# EAGLE design driver_board_one_module_pic (EAGLE 8.1.1)
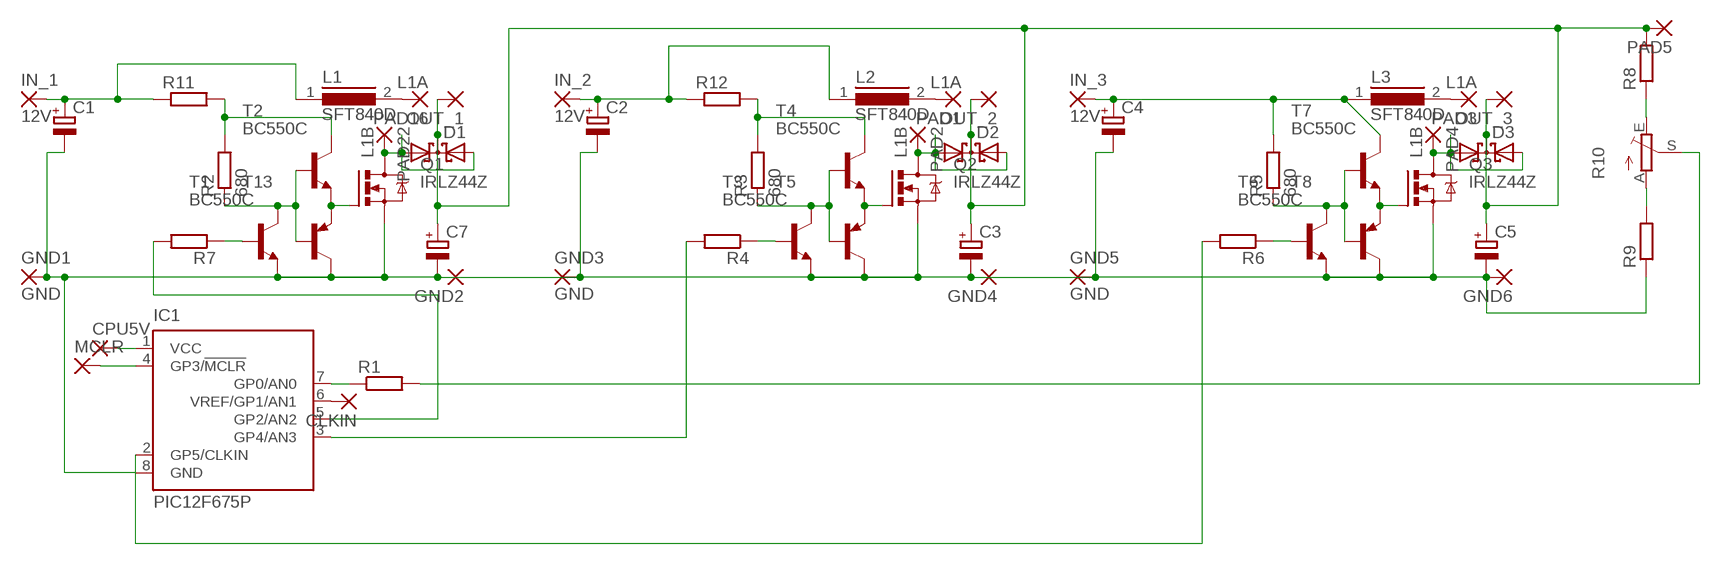
[diagram p0: schematic, sheet 1]

## Parts
C1  CPOL-EUE5-8.5  [E5-8,5]
C2  CPOL-EUE5-8.5  [E5-8,5]
C3  CPOL-EUE5-8.5  [E5-8,5]
C4  CPOL-EUE5-8.5  [E5-8,5]
C5  CPOL-EUE5-8.5  [E5-8,5]
C7  CPOL-EUE5-8.5  [E5-8,5]
CLKIN  2,54/0,8  [2,54/0,8]
CPU5V  2,54/0,8  [2,54/0,8]
D1  DIODE_2SCHOTTKY-SOT93V  [SOT93S]
D2  DIODE_2SCHOTTKY-SOT93V  [SOT93S]
D3  DIODE_2SCHOTTKY-SOT93V  [SOT93S]
GND1  GND  3,81/1,3  [3,81/1,3]
GND2  3,81/1,3  [3,81/1,3]
GND3  GND  3,81/1,3  [3,81/1,3]
GND4  3,81/1,3  [3,81/1,3]
GND5  GND  3,81/1,3  [3,81/1,3]
GND6  3,81/1,3  [3,81/1,3]
IC1  PIC12F675P  [DIL8]
IN_1  12V  3,81/1,3  [3,81/1,3]
IN_2  12V  3,81/1,3  [3,81/1,3]
IN_3  12V  3,81/1,3  [3,81/1,3]
L1  SFT840D  [SFT840D]
L2  SFT840D  [SFT840D]
L3  SFT840D  [SFT840D]
MCLR  2,54/0,8  [2,54/0,8]
OUT_1  3,81/1,3  [3,81/1,3]
OUT_2  3,81/1,3  [3,81/1,3]
OUT_3  3,81/1,3  [3,81/1,3]
PAD1  L1A  3,81/1,1  [3,81/1,1]
PAD2  L1B  3,81/1,1  [3,81/1,1]
PAD3  L1A  3,81/1,1  [3,81/1,1]
PAD4  L1B  3,81/1,1  [3,81/1,1]
PAD5  3,81/1,3  [3,81/1,3]
PAD16  L1A  3,81/1,1  [3,81/1,1]
PAD22  L1B  3,81/1,1  [3,81/1,1]
Q1  IRLZ44Z  [TO220BH]
Q2  IRLZ44Z  [TO220BH]
Q3  IRLZ44Z  [TO220BH]
R1  R-EU_0207/7  [0207/7]
R2  680  R-EU_0204/7  [0204/7]
R3  680  R-EU_0204/7  [0204/7]
R4  R-EU_0207/10  [0207/10]
R5  680  R-EU_0204/7  [0204/7]
R6  R-EU_0207/7  [0207/7]
R7  R-EU_0207/7  [0207/7]
R8  R-EU_0207/7  [0207/7]
R9  R-EU_0207/7  [0207/7]
R10  TRIM_EU-RJ9W  [RJ9W]
R11  R-EU_0207/10  [0207/10]
R12  R-EU_0207/15  [0207/15]
T1  BC550C  [TO92-EBC]
T2  BC550C  [TO92-EBC]
T3  BC550C  [TO92-EBC]
T4  BC550C  [TO92-EBC]
T5  BC557C-PNP-TO92-EBC  [TO92-EBC]
T6  BC550C  [TO92-EBC]
T7  BC550C  [TO92-EBC]
T8  BC557C-PNP-TO92-EBC  [TO92-EBC]
T13  BC557C-PNP-TO92-EBC  [TO92-EBC]

## Nets
GND: C1.- C2.- C3.- C4.- C5.- C7.- GND1.1(P) GND2.1(P) GND3.1(P) GND4.1(P) GND5.1(P) GND6.1(P) IC1.8(GND) Q1.S Q2.S Q3.S R9.1 T1.E T3.E T5.C T6.E T8.C T13.C
N$1: Q1.G T2.E T13.E
N$2: IC1.7(GP0/AN0) R1.1
N$3: Q2.G T4.E T5.E
N$4: R3.1 T3.C T4.B T5.B
N$5: R9.2 R10.A
N$6: R4.1 T3.B
N$7: R2.1 T1.C T2.B T13.B
N$9: D2.A1 D2.A2 PAD2.1(P) Q2.D
N$10: R8.1 R10.E
N$11: L2.2 PAD1.1(P)
N$12: Q3.G T7.E T8.E
N$14: R5.1 T6.C T7.B T8.B
N$15: R1.2 R10.S
N$16: R6.1 T6.B
N$17: R2.2 R11.2 T2.C
N$18: D3.A1 D3.A2 PAD4.1(P) Q3.D
N$19: CPU5V.1(P) IC1.1(VCC)
N$20: R7.1 T1.B
N$21: L3.2 PAD3.1(P)
N$22: IC1.5(GP2/AN2) R7.2
N$23: IC1.3(GP4/AN3) R4.2
N$24: IC1.2(GP5/CLKIN) R6.2
N$26: IC1.4(GP3/!MCLR) MCLR.1(P)
N$27: CLKIN.1(P) IC1.6(VREF/GP1/AN1)
N$28: C1.+ IN_1.1(P) L1.1 R11.1
N$29: C2.+ IN_2.1(P) L2.1 R12.1
N$30: C4.+ IN_3.1(P) L3.1 R5.2 T7.C
N$31: R3.2 R12.2 T4.C
N$33: L1.2 PAD16.1(P)
N$34: D1.A1 D1.A2 PAD22.1(P) Q1.D
N$35: C3.+ C5.+ C7.+ D1.C D2.C D3.C OUT_1.1(P) OUT_2.1(P) OUT_3.1(P) PAD5.1(P) R8.2

## Library data of the parts
C1-C5 C7 = rcl:CPOL-EU: POLARIZED CAPACITOR, European symbol
CLKIN CPU5V MCLR = wirepad:2,54/0,8: THROUGH-HOLE PAD
D1-D3 = diode:DIODE_2SCHOTTKY-: Dual SCHOTTKY DIODE common cathode
GND1-GND6 IN_1-IN_3 OUT_1-OUT_3 PAD5 = wirepad:3,81/1,3: THROUGH-HOLE PAD
IC1 = microchip:PIC12F675: 8-Pin FLASH-Based 8-Bit CMOS Microcontroller Precision Internal 4 MHz oscillator factory calibrated to ±1% Low Power Features: Standby Current: - 1 nA @ 2.0V, typical Operating Current: - 8.5µA @ 32 kHz, 2.0V, typical - 100µA @ 1 MHz, 2.0V, typical Watchdog Timer Current: - 300 nA @ 2.0V, typical Timer1 oscillator current: - 4µA @ 32 kHz, 2.0V, typical Analog-to-Digital Converter module: - 10-bit resolution - Programmable 4-channel input - Voltage reference input Source: http://www.microchip.com .. 41190E.pdf; MF: MICROCHIP; MPN: PIC12F675-E/P; OC_FARNELL: 9759018; OC_NEWARK: 92C4340
L1-L3 = inductors:SFT840D: INDUCTOR
PAD1-PAD4 PAD16 PAD22 = wirepad:3,81/1,1: THROUGH-HOLE PAD
Q1-Q3 = transistor-power:IRLZ44Z: N-Channel HEXFET® Power MOSFET Logic Level AUTOMOTIVE MOSFET Source: http://www.irf.com/product-info/datasheets/data/irlz44zpbf.pdf
R1-R3 R5-R9 R11 = resistor:R-EU_: RESISTOR, European symbol
R4 R12 = rcl:R-EU_: RESISTOR, European symbol
R10 = pot:TRIM_EU-: POTENTIOMETER
T1-T4 T6 T7 = transistor-npn:BC550*: NPN Transistor
T5 T8 T13 = transistor:*-PNP-: PNP Transistror

## Board
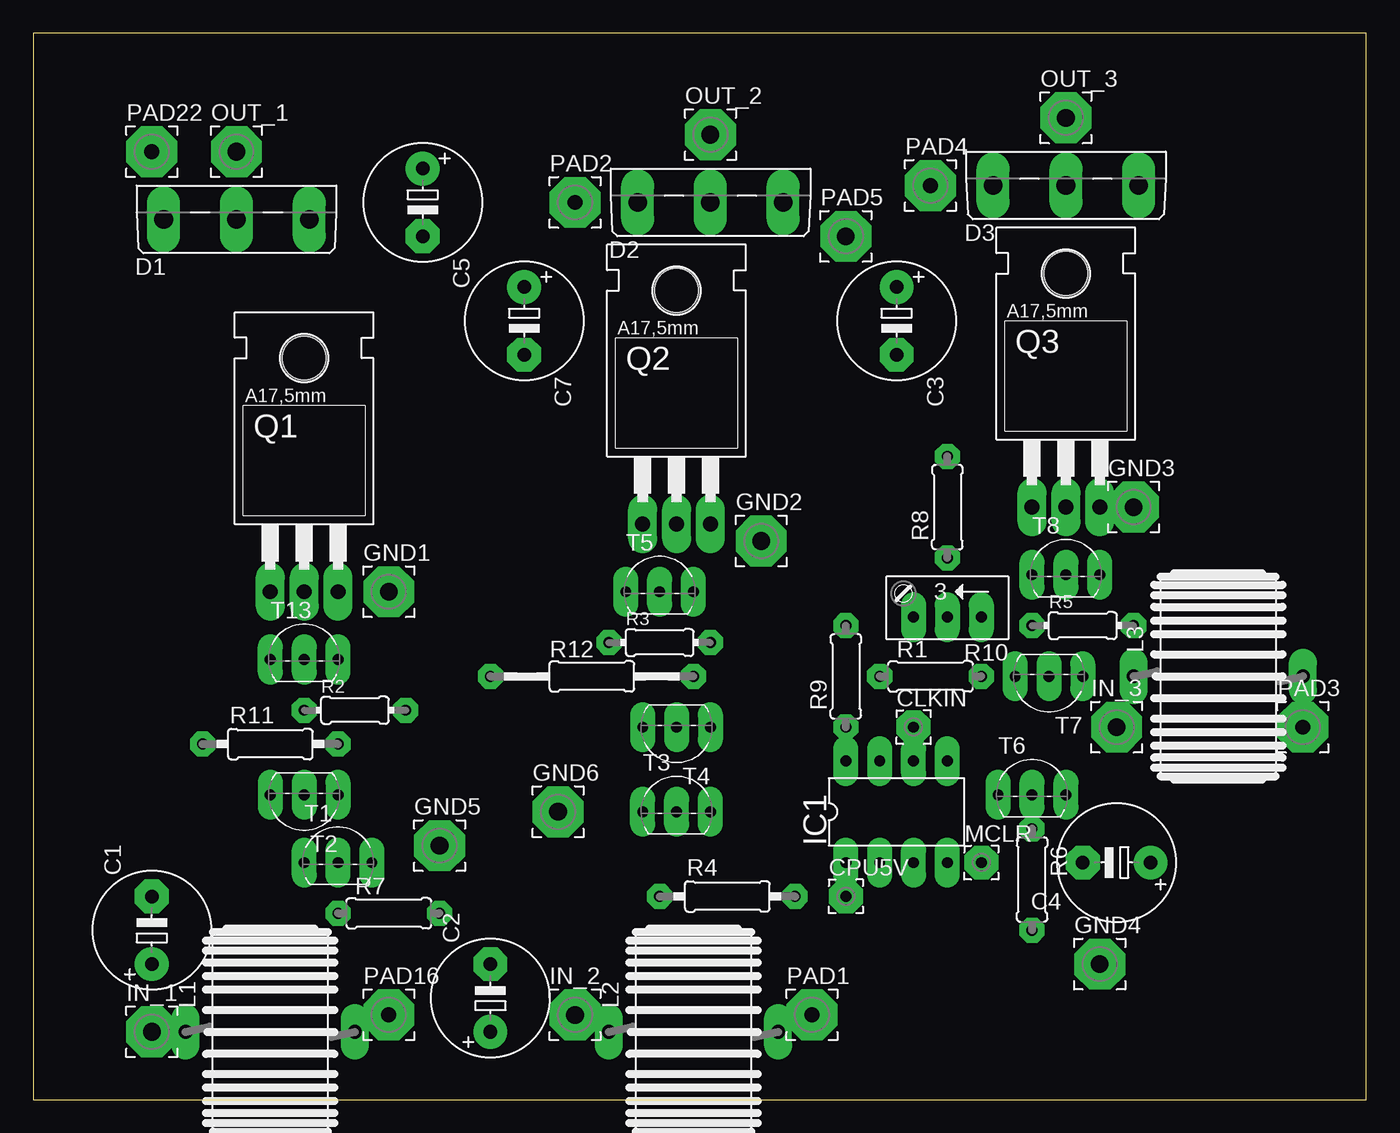
[diagram p1: board, top side]
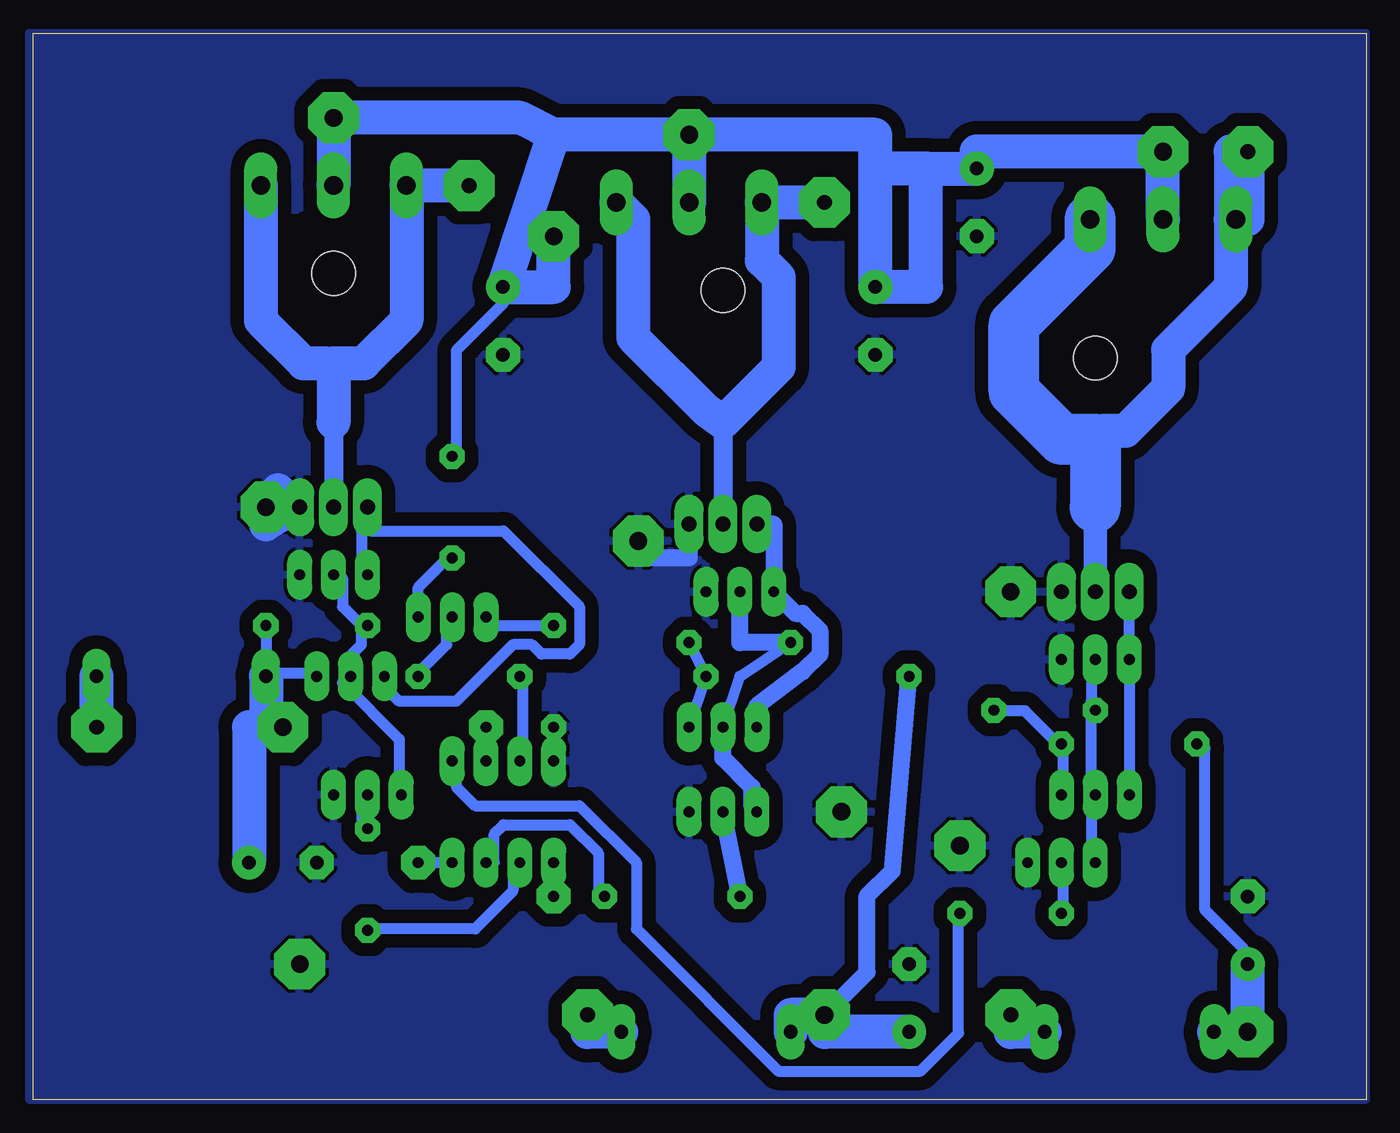
[diagram p2: board, bottom side, seen from below]

Size 100 x 80 mm. Coordinates in mm from the lower left corner, seen from the top.
Outline: 0,0 100,0 100,80 0,80 0,0
Copper layers (1*16): Top 0.035mm / dielectric 1.5mm / Bottom 0.035mm
Design rules "default *": minimum track width 38mil, minimum drill 22mil, track to track 24mil, track to pad 24mil, pad to pad 18mil, via to via 16mil, smd to smd 7mil, copper to edge 0mil, drill to drill 8mil, minimum pad ring 21mil, minimum via ring 8mil, stop-mask expansion 4mil, vias tented up to drill 0mil, thermal gap 10mil

### Footprints (pad centres in the part's own frame; a part is rotated, then mirrored left to right if it is on the bottom)
E5-8,5 = drill 1.016 pad 2.54: + -2.54,0 | drill 1.016 pad 2.54 octagon: - 2.54,0
2,54/0,8 = drill 0.813 pad 2.54 octagon: 1 0,0
SOT93S = drill 1.397 long: A1 -5.461,-2.54; A2 5.461,-2.54; C 0,-2.54
3,81/1,3 = drill 1.321 pad 3.81 octagon: 1 0,0
DIL8 = drill 0.813 long: 1 -3.81,-3.81; 2 -1.27,-3.81; 3 1.27,-3.81; 4 3.81,-3.81; 5 3.81,3.81; 6 1.27,3.81; 7 -1.27,3.81; 8 -3.81,3.81
SFT840D = drill 1.016 long: 1 -6.35,0; 2 6.35,0
3,81/1,1 = drill 1.118 pad 3.81 octagon: 1 0,0
TO220BH = drill 1.118 long: D 0,-6.35; G -2.54,-6.35; S 2.54,-6.35 | hole 3.302: 0,11.176
0207/7 = drill 0.813 octagon: 1 -3.81,0; 2 3.81,0
0204/7 = drill 0.813 octagon: 1 -3.81,0; 2 3.81,0
0207/10 = drill 0.813 octagon: 1 -5.08,0; 2 5.08,0
RJ9W = drill 0.813 long: A 2.54,0.635; E -2.54,0.635; S 0,0.635
0207/15 = drill 0.813 octagon: 1 -7.62,0; 2 7.62,0
TO92-EBC = drill 0.813 long: B 0,-1.27; C -2.54,-1.27; E 2.54,-1.27
TO92-EBC' = drill 0.813 long: B 0,-1.27; C 2.54,-1.27; E -2.54,-1.27

### Placement (x,y rotation side)
C1  8.89,12.7 90 top
C2  34.29,7.62 90 top
C3  64.77,58.42 270 top
C4  81.28,17.78 180 top
C5  29.21,67.31 270 top
C7  36.83,58.42 270 top
CLKIN  66.04,27.94 0 top
CPU5V  60.96,15.24 0 top
D1  15.24,68.58 0 top
D2  50.8,69.85 0 top
D3  77.47,71.12 0 top
GND1  26.67,38.1 0 top
GND2  54.61,41.91 0 top
GND3  82.55,44.45 0 top
GND4  80.01,10.16 0 top
GND5  30.48,19.05 0 top
GND6  39.37,21.59 0 top
IC1  64.77,21.59 0 top
IN_1  8.89,5.08 0 top
IN_2  40.64,6.35 0 top
IN_3  81.28,27.94 0 top
L1  17.78,5.08 0 top
L2  49.53,5.08 0 top
L3  88.9,31.75 0 top
MCLR  71.12,17.78 0 top
OUT_1  15.24,71.12 0 top
OUT_2  50.8,72.39 0 top
OUT_3  77.47,73.66 0 top
PAD1  58.42,6.35 0 top
PAD2  40.64,67.31 0 top
PAD3  95.25,27.94 0 top
PAD4  67.31,68.58 0 top
PAD5  60.96,64.77 0 top
PAD16  26.67,6.35 0 top
PAD22  8.89,71.12 0 top
Q1  20.32,44.45 0 top
Q2  48.26,49.53 0 top
Q3  77.47,50.8 0 top
R1  67.31,31.75 0 top
R2  24.13,29.21 0 top
R3  46.99,34.29 0 top
R4  52.07,15.24 0 top
R5  78.74,35.56 0 top
R6  74.93,16.51 270 top
R7  26.67,13.97 0 top
R8  68.58,44.45 90 top
R9  60.96,31.75 90 top
R10  68.58,36.83 180 top
R11  17.78,26.67 0 top
R12  41.91,31.75 0 top
T1  22.86,19.05 0 top
T2  20.32,21.59 180 top
T3  48.26,22.86 0 top
T4  48.26,26.67 180 top
T5  [TO92-EBC']  46.99,39.37 0 top
T6  74.93,24.13 0 top
T7  76.2,30.48 180 top
T8  [TO92-EBC']  77.47,40.64 0 top
T13  [TO92-EBC']  20.32,34.29 0 top

### Tracks (layer width: path | path; a pad name or v marks a point on that pad's centre or on a via)
GND
  Bottom 1.27: Q2.S 50.8,40.64 54.61,40.64 GND2.1
  Bottom 2.54: GND3.1 81.64,45.72 80.37,44.45 82.55,43.18 GND3.1
  pour Bottom (isolate 1.016): 0,80.01 100.33,80.01 100.33,0 0,0
N$1
  Bottom 0.813: T2.E T13.E Q1.G
N$2
  Bottom 0.813: IC1.7 63.3,25.6 63.3,31.29 R1.1
N$3
  Bottom 1.27: Q2.G 44.45,43.18 T5.E 42.82,36.47 42.27,36.47 41,35.2 41,33.38 42.27,32.11 45.72,29.52 T4.E
N$4
  Bottom 0.813: T4.B 46.99,31.75 R3.1
  Bottom 1.27: R3.1 46.99,34.29 T5.B | T3.C 46.08,21.95 46.08,23.43 48.26,25.62 T4.B
N$5
  Bottom 0.813: R9.2 65.43,35.56 R10.A
N$6
  Bottom 1.27: R4.1 T3.B
N$7
  Bottom 0.813: T13.B 20.62,32.72 20.62,29.87 R2.1 20.62,29.16 20.62,23.47 T2.B 20.62,22.76 20.62,17.78 T1.C
N$9
  Bottom 1.422: 48.26,50.8 Q2.D
  Bottom 2.54: D2.A2 54.99,66.04 54.99,57.17 49.53,51.71 48.26,50.8 44.07,54.99 44.07,61.7 45.34,62.97 D2.A1 PAD2.1
N$10
  Bottom 0.813: R10.E 71.12,38.41 68.99,40.54 R8.1
N$11
  Bottom 2.54: L2.2 58.42,5.08 PAD1.1
N$12
  Bottom 0.813: T7.E 73.25,31.29 73.25,30.58 72.54,29.87 68.28,29.87 64.01,34.14 62.59,34.14 61.87,33.43 59.74,33.43 59.03,34.14 59.03,36.98 64.72,42.67 74.68,42.67 Q3.G 75.39,42.67 75.39,39.83 T8.E
N$14
  Bottom 0.813: 75.39,35.56 76.81,36.98 76.81,39.12 T8.B | T6.C 72.54,23.47 72.54,27.03 76.81,31.29 T7.B 76.1,32 76.1,33.43 75.39,34.14 75.39,35.56 | 75.39,35.56 R5.1
N$15
  Bottom 0.813: R10.S 68.99,35.56 68.99,34.14 71.12,32 R1.2
N$16
  Bottom 0.813: R6.1 75.39,20.62 75.39,22.76 T6.B
N$17
  Bottom 0.813: T2.C 22.76,23.47 22.76,26.31 R11.2 23.47,27.03 25.6,29.16 27.74,29.16 R2.2
N$18
  Bottom 1.422: 77.47,50.8 Q3.D
  Bottom 2.54: PAD4.1 D3.A1 72.01,58.44 75.21,55.24 77.47,55.24 77.47,54.61 | 77.47,54.61 77.47,50.8 | 77.47,54.61 78.11,55.24 79.73,55.24 82.93,58.44 D3.A2
N$19
  Bottom 0.813: IC1.1 61.16,17.78 61.16,15.65 CPU5V.1
N$20
  Bottom 0.813: R7.1 22.76,14.22 22.76,17.78 T1.B
N$21
  Bottom 2.54: PAD3.1 L3.2
N$22
  Bottom 0.813: R7.2 30.58,13.51 30.58,4.98 33.43,2.13 44.09,2.13 54.76,12.8 54.76,17.78 59.03,22.05 66.85,22.05 68.28,23.47 68.28,24.89 IC1.5
N$23
  Bottom 0.813: R4.2 57.61,15.65 57.61,18.49 59.74,20.62 64.72,20.62 65.43,19.91 65.43,17.78 IC1.3
N$24
  Bottom 0.813: R6.2 74.68,12.8 66.85,12.8 64.01,15.65 64.01,17.78 IC1.2
N$26
  Bottom 0.813: IC1.4 70.41,17.78 71.12,18.49 MCLR.1
N$27
  Bottom 0.813: IC1.6 66.14,25.6 66.14,27.74 CLKIN.1
N$28
  Bottom 0.813: R11.1 12.09,26.31 12.09,14.22 9.25,11.38 C1.+
  Bottom 2.54: L1.1 IN_1.1 C1.+
N$29
  Bottom 1.27: R12.1 35.56,17.15 37.44,15.28 37.44,9.55 IN_2.1
  Bottom 2.54: C2.+ 40.64,5.08 IN_2.1 43.18,6.35 L2.1
N$30
  Bottom 0.813: T7.C 78.94,32 81.79,32 L3.1 82.5,32.72 82.5,35.56 R5.2
  Bottom 2.54: L3.1 82.55,27.94 IN_3.1 83.82,27.94 C4.+
N$31
  Bottom 0.813: R3.2 R12.2 T4.C
N$33
  Bottom 2.54: L1.2 26.67,5.08 PAD16.1
N$34
  Bottom 1.778: Q1.D 20.32,44.45
  Bottom 2.54: 10.16,66.04 D1.A1 8.89,66.04 PAD22.1 10.16,71.12 10.16,66.04 | 10.16,66.04 10.16,60.96 14.86,56.26 14.86,53.36 18.06,50.16 19.68,50.16 20.32,49.53
  Bottom 3.81: 20.32,44.45 20.32,49.53 22.84,49.53 26.42,53.1 26.42,58.15 20.7,63.87 D1.A2
N$35
  Bottom 0.813: R8.2 68.28,48.36 68.28,56.19 64.72,59.74 C3.+ | 60.96,63.5 61.16,64.72 PAD5.1
  Bottom 2.54: D1.C OUT_1.1 29.21,71.12 C5.+ 33.02,69.85 | 33.02,69.85 33.02,60.96 C7.+ 36.83,69.85 | OUT_2.1 36.83,72.39 36.83,69.85 | OUT_2.1 D2.C | OUT_2.1 60.96,72.39 | 60.96,72.39 C3.+ 60.96,60.96 60.96,63.5 | 60.96,72.39 63.5,73.66 OUT_3.1 D3.C | 33.02,69.85 36.83,69.85